# EAGLE design mixer-board2 (EAGLE 9.6.2)
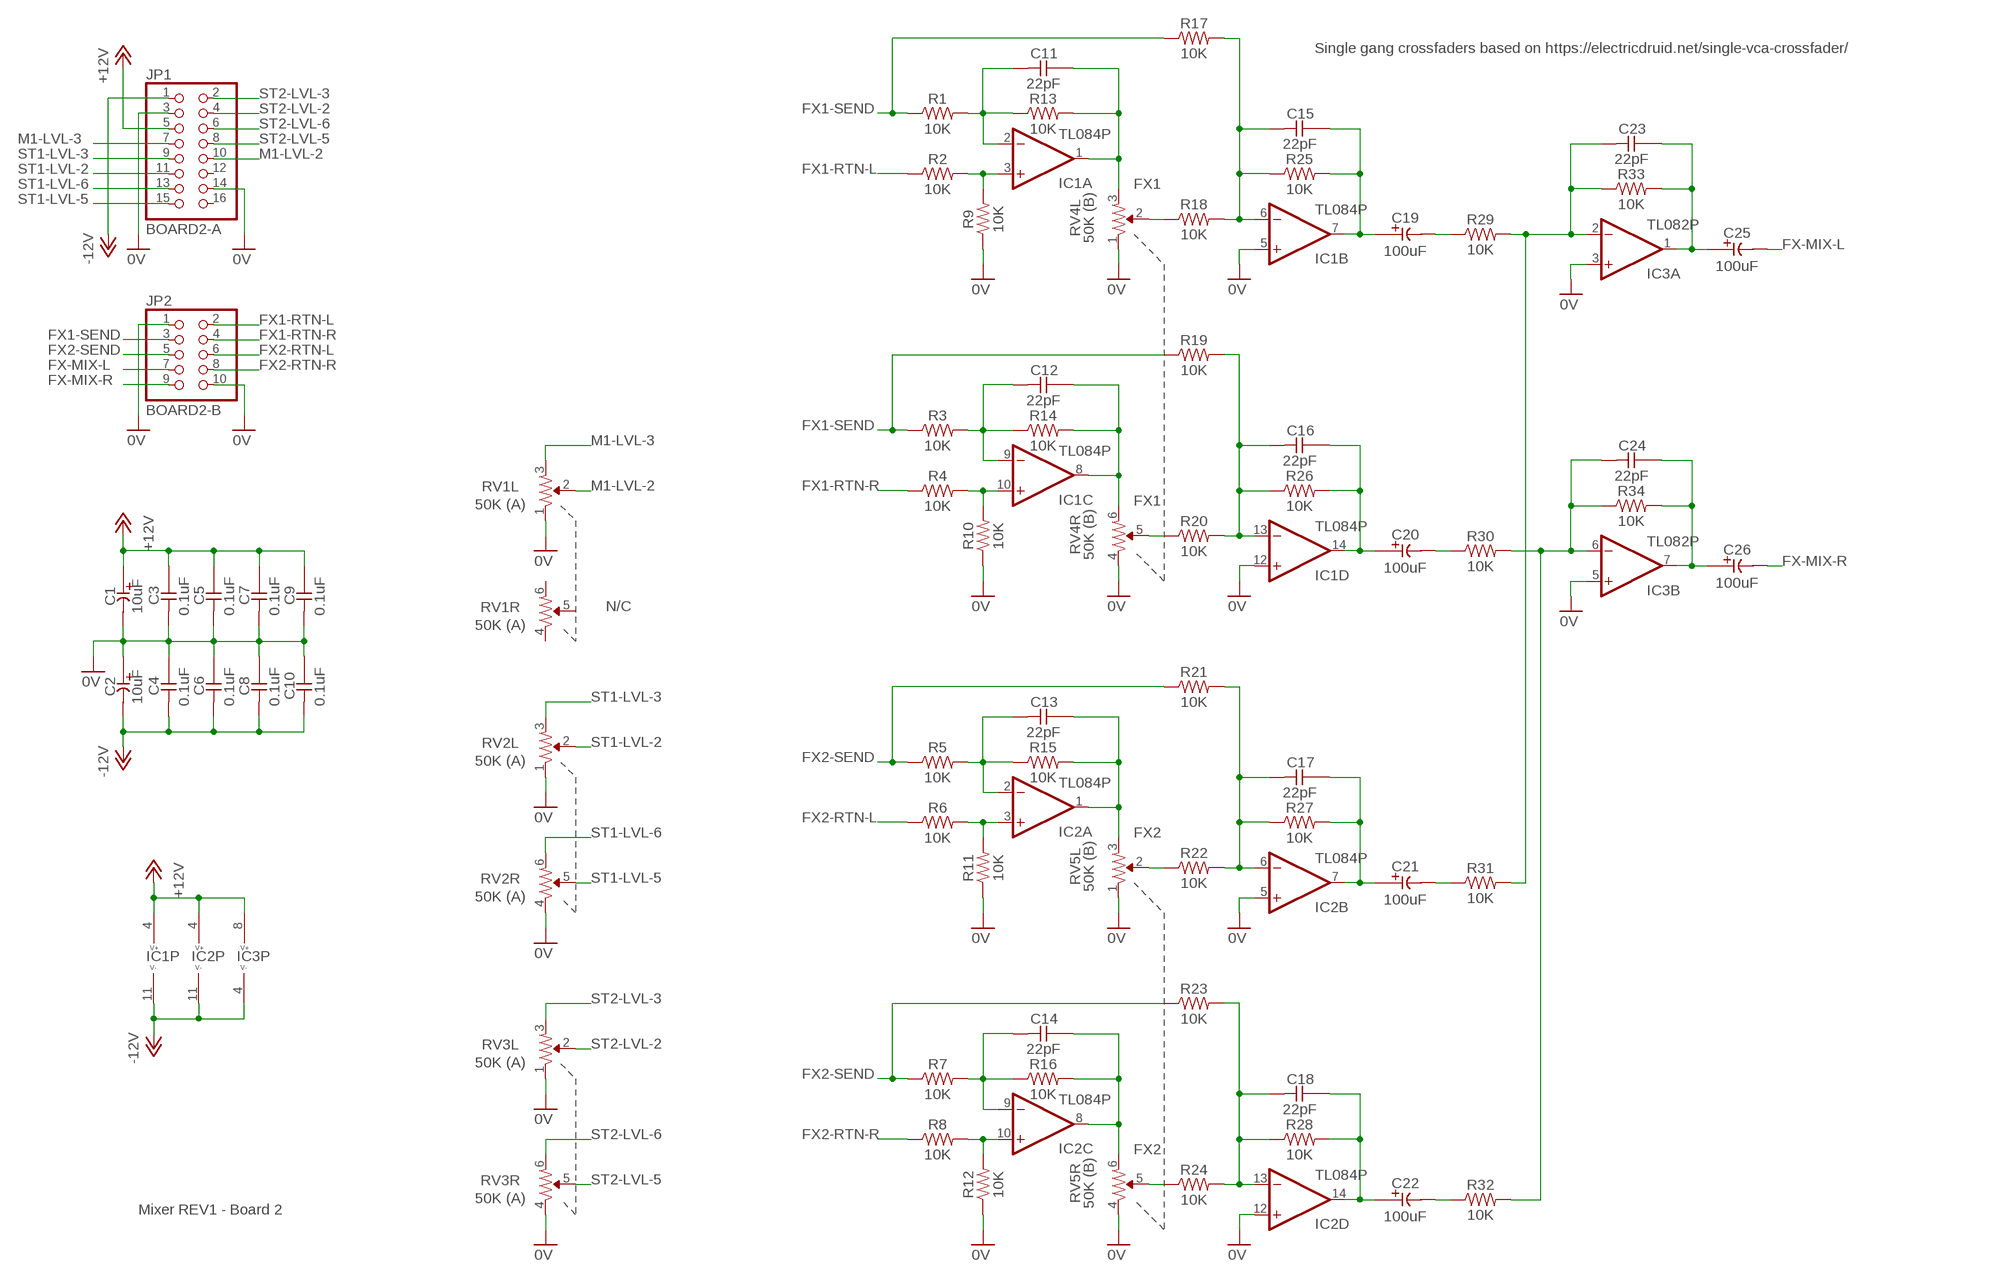
[diagram p0: schematic, sheet 1]

## Parts
C1  10uF  CE-USE2-5  [E2-5]
C2  10uF  CE-USE2-5  [E2-5]
C3  0.1uF  CC-US025-024X044  [C025-024X044]
C4  0.1uF  CC-US025-024X044  [C025-024X044]
C5  0.1uF  CC-US025-024X044  [C025-024X044]
C6  0.1uF  CC-US025-024X044  [C025-024X044]
C7  0.1uF  CC-US025-024X044  [C025-024X044]
C8  0.1uF  CC-US025-024X044  [C025-024X044]
C9  0.1uF  CC-US025-024X044  [C025-024X044]
C10  0.1uF  CC-US025-024X044  [C025-024X044]
C11  22pF  CC-US025-024X044  [C025-024X044]
C12  22pF  CC-US025-024X044  [C025-024X044]
C13  22pF  CC-US025-024X044  [C025-024X044]
C14  22pF  CC-US025-024X044  [C025-024X044]
C15  22pF  CC-US025-024X044  [C025-024X044]
C16  22pF  CC-US025-024X044  [C025-024X044]
C17  22pF  CC-US025-024X044  [C025-024X044]
C18  22pF  CC-US025-024X044  [C025-024X044]
C19  100uF  CE-USE5-8.5  [E5-8,5]
C20  100uF  CE-USE5-8.5  [E5-8,5]
C21  100uF  CE-USE5-8.5  [E5-8,5]
C22  100uF  CE-USE5-8.5  [E5-8,5]
C23  22pF  CC-US025-024X044  [C025-024X044]
C24  22pF  CC-US025-024X044  [C025-024X044]
C25  100uF  CE-USE5-8.5  [E5-8,5]
C26  100uF  CE-USE5-8.5  [E5-8,5]
IC1  TL084P  [DIL14]
IC2  TL084P  [DIL14]
IC3  TL082P  [DIL08]
JP1  BOARD2-A  PINHD-2X8  [2X08]
JP2  BOARD2-B  PINHD-2X5  [2X05]
R1  10K  R  [0207/7]
R2  10K  R  [0207/7]
R3  10K  R  [0207/7]
R4  10K  R  [0207/7]
R5  10K  R  [0207/7]
R6  10K  R  [0207/7]
R7  10K  R  [0207/7]
R8  10K  R  [0207/7]
R9  10K  R  [0207/7]
R10  10K  R  [0207/7]
R11  10K  R  [0207/7]
R12  10K  R  [0207/7]
R13  10K  R  [0207/7]
R14  10K  R  [0207/7]
R15  10K  R  [0207/7]
R16  10K  R  [0207/7]
R17  10K  R  [0207/7]
R18  10K  R  [0207/7]
R19  10K  R  [0207/7]
R20  10K  R  [0207/7]
R21  10K  R  [0207/7]
R22  10K  R  [0207/7]
R23  10K  R  [0207/7]
R24  10K  R  [0207/7]
R25  10K  R  [0207/7]
R26  10K  R  [0207/7]
R27  10K  R  [0207/7]
R28  10K  R  [0207/7]
R29  10K  R  [0207/7]
R30  10K  R  [0207/7]
R31  10K  R  [0207/7]
R32  10K  R  [0207/7]
R33  10K  R  [0207/7]
R34  10K  R  [0207/7]
RV1  50K (A)  R-VAR-ST  [_COMMON_3RP/1610G]
RV2  50K (A)  R-VAR-ST  [_COMMON_3RP/1610G]
RV3  50K (A)  R-VAR-ST  [_COMMON_3RP/1610G]
RV4  50K (B)  R-VAR-ST  [_COMMON_3RP/1610G]
RV5  50K (B)  R-VAR-ST  [_COMMON_3RP/1610G]

## Nets
0V [power]: C1.- C2.+ C3.2 C4.1 C5.2 C6.1 C7.2 C8.1 C9.2 C10.1 IC1.5(B:+IN) IC1.12(D:+IN) IC2.5(B:+IN) IC2.12(D:+IN) IC3.3(A:+IN) IC3.5(B:+IN) JP1.3 JP1.14 JP2.1 JP2.10 R9.1 R10.1 R11.1 R12.1 RV1.1 RV2.1 RV2.4 RV3.1 RV3.4 RV4.1 RV4.4 RV5.1 RV5.4
+12V [power]: C1.+ C3.1 C5.1 C7.1 C9.1 IC1.4(P:V+) IC2.4(P:V+) IC3.8(P:V+) JP1.5
-12V [power]: C2.- C4.2 C6.2 C8.2 C10.2 IC1.11(P:V-) IC2.11(P:V-) IC3.4(P:V-) JP1.1
FX1-RTN-L: JP2.2 R2.1
FX1-RTN-R: JP2.4 R4.1
FX1-SEND: JP2.3 R1.1 R3.1 R17.1 R19.1
FX2-RTN-L: JP2.6 R6.1
FX2-RTN-R: JP2.8 R8.1
FX2-SEND: JP2.5 R5.1 R7.1 R21.1 R23.1
FX-MIX-L: C25.- JP2.7
FX-MIX-R: C26.- JP2.9
M1-LVL-2: JP1.10 RV1.2
M1-LVL-3: JP1.7 RV1.3
N$1: C11.1 IC1.1(A:OUT) R13.2 RV4.3
N$2: R18.1 RV4.2
N$3: C15.2 IC1.6(B:-IN) R17.2 R18.2 R25.1
N$4: C15.1 C19.+ IC1.7(B:OUT) R25.2
N$5: C12.2 IC1.9(C:-IN) R3.2 R14.1
N$6: R20.1 RV4.5
N$7: C11.2 IC1.2(A:-IN) R1.2 R13.1
N$8: IC1.3(A:+IN) R2.2 R9.2
N$9: C19.- R29.1
N$11: C23.1 C25.+ IC3.1(A:OUT) R33.2
N$12: C12.1 IC1.8(C:OUT) R14.2 RV4.6
N$13: C13.1 IC2.1(A:OUT) R15.2 RV5.3
N$14: R22.1 RV5.2
N$15: IC1.10(C:+IN) R4.2 R10.2
N$16: C16.2 IC1.13(D:-IN) R19.2 R20.2 R26.1
N$17: C16.1 C20.+ IC1.14(D:OUT) R26.2
N$18: C17.2 IC2.6(B:-IN) R21.2 R22.2 R27.1
N$19: C20.- R30.1
N$21: C17.1 C21.+ IC2.7(B:OUT) R27.2
N$22: C24.1 C26.+ IC3.7(B:OUT) R34.2
N$23: C13.2 IC2.2(A:-IN) R5.2 R15.1
N$24: IC2.3(A:+IN) R6.2 R11.2
N$25: C21.- R31.1
N$26: C23.2 IC3.2(A:-IN) R29.2 R31.2 R33.1
N$27: C14.2 IC2.9(C:-IN) R7.2 R16.1
N$28: C14.1 IC2.8(C:OUT) R16.2 RV5.6
N$29: IC2.10(C:+IN) R8.2 R12.2
N$30: R24.1 RV5.5
N$31: C18.2 IC2.13(D:-IN) R23.2 R24.2 R28.1
N$32: C18.1 C22.+ IC2.14(D:OUT) R28.2
N$33: C22.- R32.1
N$34: C24.2 IC3.6(B:-IN) R30.2 R32.2 R34.1
ST1-LVL-2: JP1.11 RV2.2
ST1-LVL-3: JP1.9 RV2.3
ST1-LVL-5: JP1.15 RV2.5
ST1-LVL-6: JP1.13 RV2.6
ST2-LVL-2: JP1.4 RV3.2
ST2-LVL-3: JP1.2 RV3.3
ST2-LVL-5: JP1.8 RV3.5
ST2-LVL-6: JP1.6 RV3.6
Unconnected: JP1.12 JP1.16 RV1.4 RV1.5 RV1.6

## Notes on the sheet
- Single gang crossfaders based on https://electricdruid.net/single-vca-crossfader/
- FX1
- FX1
- N/C
- FX2
- FX2
- Mixer REV1 - Board 2

## Library data of the parts
C1 C2 = _common.v1:CE-US: ELECTROLYTIC CAPACITOR, US symbol
C3-C10 = _common.v1:CC-US: CAPACITOR, US symbol
C11-C18 C23 C24 = _common:CC-US: CAPACITOR, US symbol
C19-C22 C25 C26 = _common:CE-US: ELECTROLYTIC CAPACITOR, US symbol
IC1 IC2 = _common:TL084: OP AMP
IC3 = _common:TL082: OP AMP
JP1 = pinhead:PINHD-2X8: PIN HEADER
JP2 = pinhead:PINHD-2X5: PIN HEADER
R1-R34 = _common:R: RESISTOR, US symbol
RV1-RV5 = _common:R-VAR-ST

## Net classes
0 default: width 0.305 mm, clearance 0.305 mm
1 power: width 0.711 mm, clearance 0.305 mm

## Board
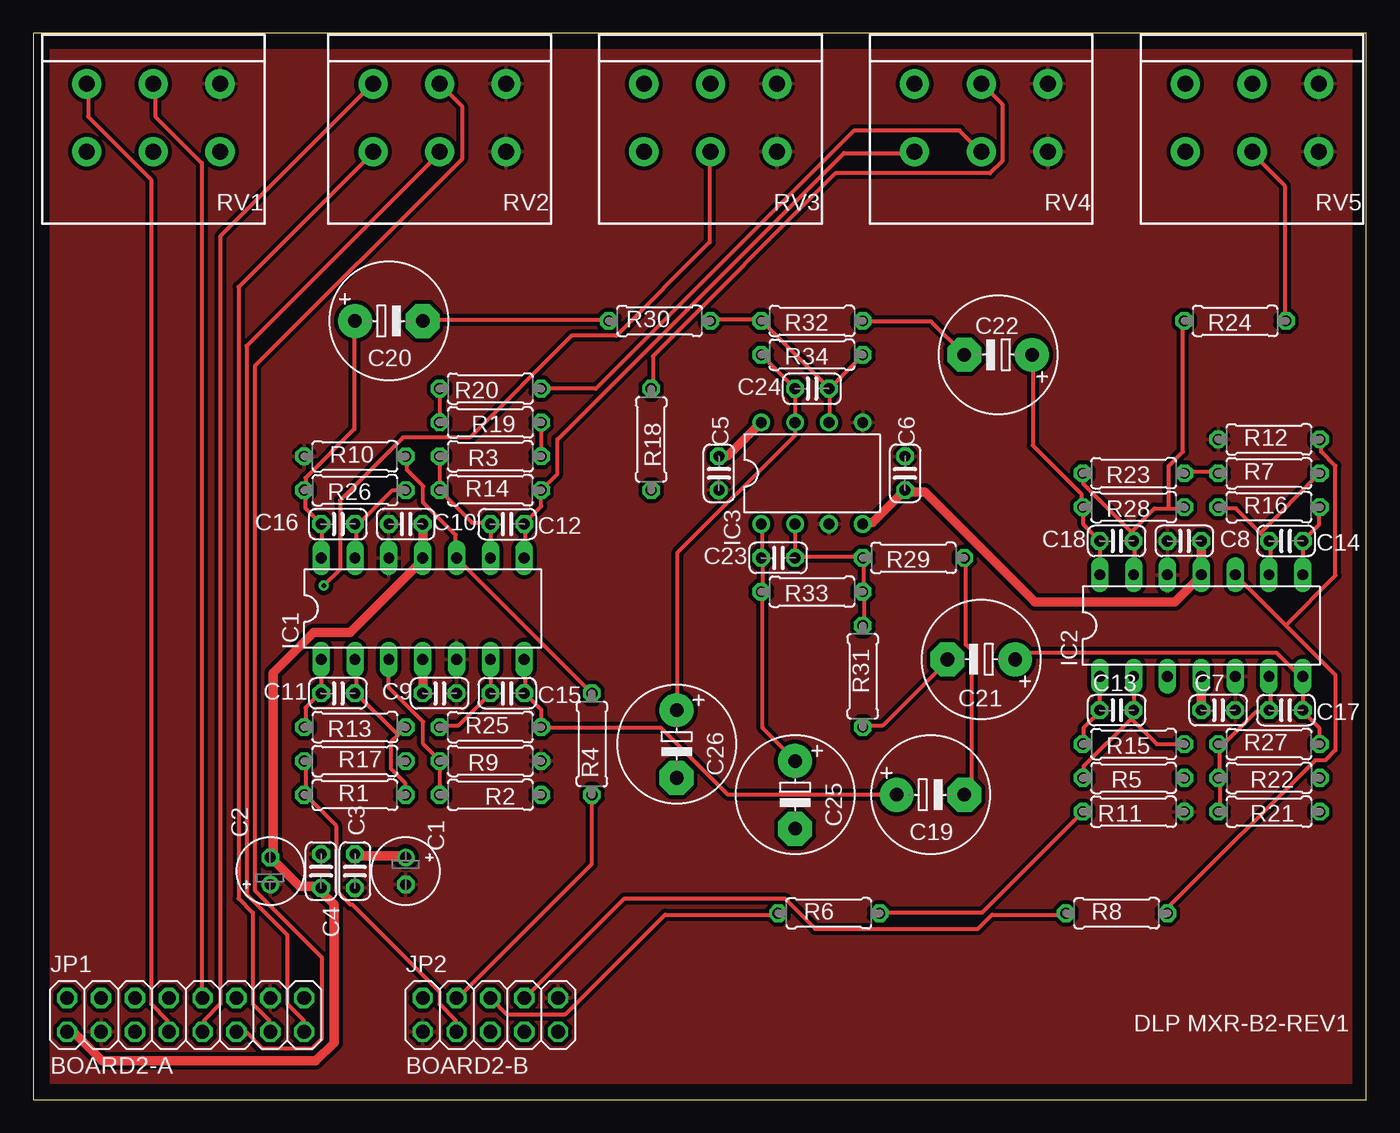
[diagram p1: board, top side]
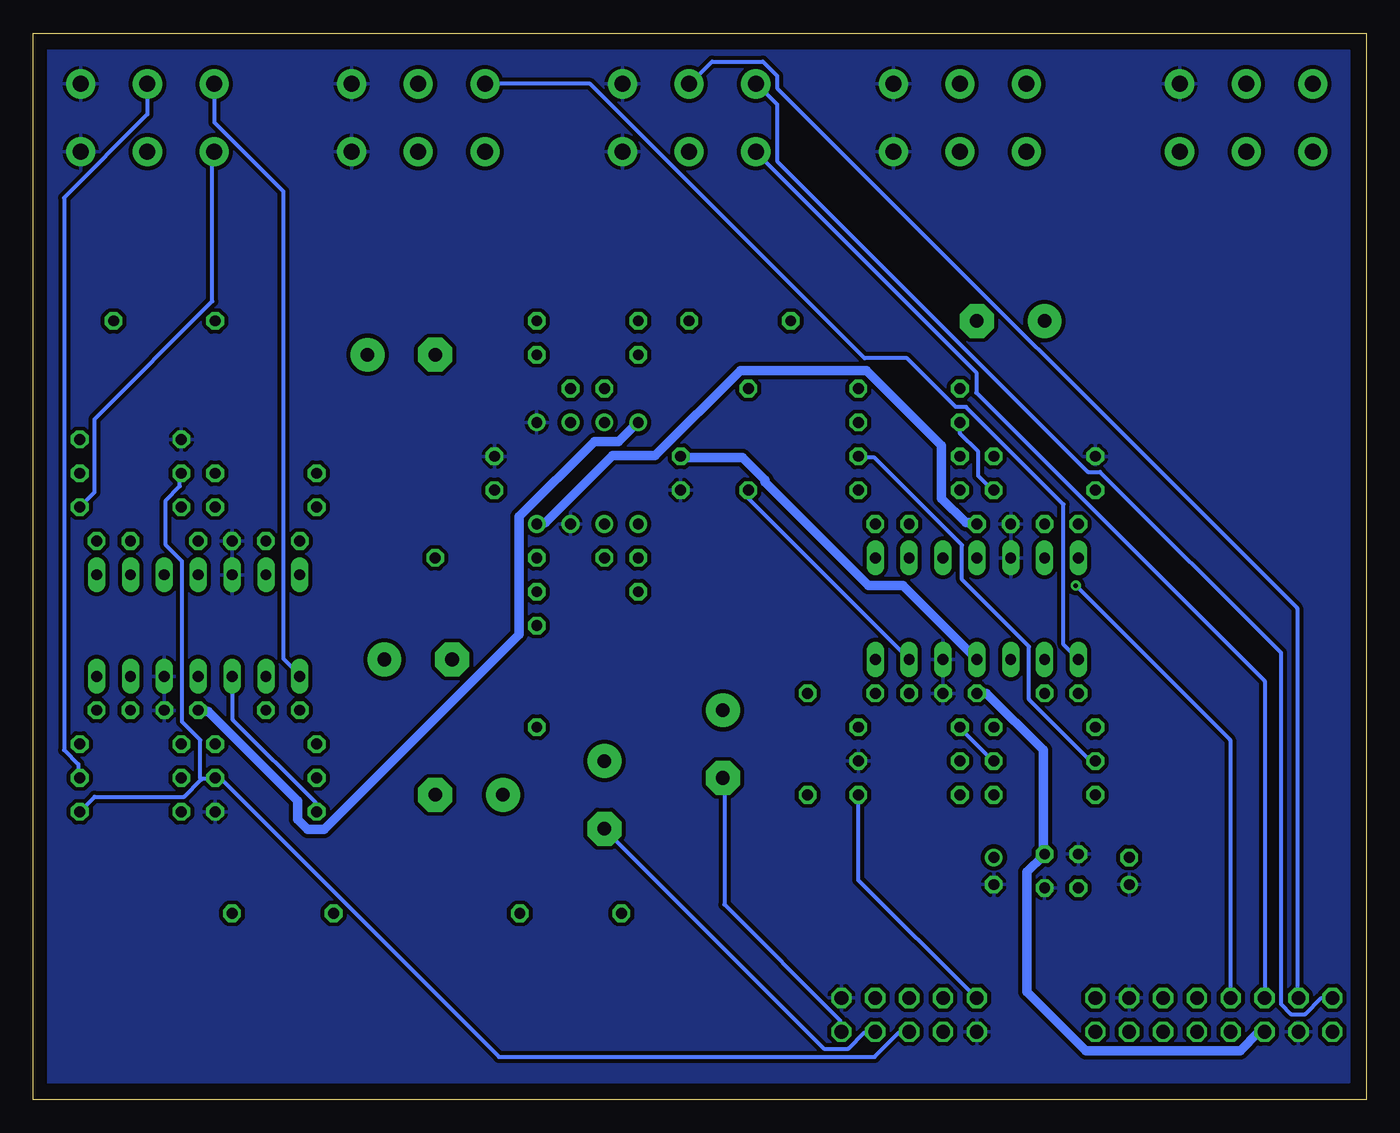
[diagram p2: board, bottom side, seen from below]

Size 100 x 80 mm. Coordinates in mm from the lower left corner, seen from the top.
Outline: 0,0 100,0 100,80 0,80 0,0
Copper layers (1*16): Top 0.035mm / dielectric 1.5mm / Bottom 0.035mm
Design rules "default": minimum track width 6mil, minimum drill 0.35mm, track to track 6mil, track to pad 6mil, pad to pad 6mil, via to via 6mil, smd to smd 6mil, copper to edge 40mil, drill to drill 6mil, minimum pad ring 10mil, minimum via ring 8mil, stop-mask expansion 4mil, vias tented up to drill 0mil, thermal gap 10mil

### Footprints (pad centres in the part's own frame; a part is rotated, then mirrored left to right if it is on the bottom)
E2-5 = drill 0.813 pad 1.27: + -1.016,0 | drill 0.813 pad 1.27 octagon: - 1.016,0
C025-024X044 = drill 0.813 octagon: 1 -1.27,0; 2 1.27,0
E5-8,5 = drill 1.016 pad 2.54: + -2.54,0 | drill 1.016 pad 2.54 octagon: - 2.54,0
DIL14 = drill 0.813 long: 1 -7.62,-3.81; 2 -5.08,-3.81; 3 -2.54,-3.81; 4 0,-3.81; 5 2.54,-3.81; 6 5.08,-3.81; 7 7.62,-3.81; 8 7.62,3.81; 9 5.08,3.81; 10 2.54,3.81; 11 0,3.81; 12 -2.54,3.81; 13 -5.08,3.81; 14 -7.62,3.81
DIL08 = drill 0.813 pad 1.27: 1 -3.81,-3.81; 2 -1.27,-3.81; 3 1.27,-3.81; 4 3.81,-3.81; 5 3.81,3.81; 6 1.27,3.81; 7 -1.27,3.81; 8 -3.81,3.81
2X08 = drill 1.016 octagon: 1 -8.89,-1.27; 2 -8.89,1.27; 3 -6.35,-1.27; 4 -6.35,1.27; 5 -3.81,-1.27; 6 -3.81,1.27; 7 -1.27,-1.27; 8 -1.27,1.27; 9 1.27,-1.27; 10 1.27,1.27; 11 3.81,-1.27; 12 3.81,1.27; 13 6.35,-1.27; 14 6.35,1.27; 15 8.89,-1.27; 16 8.89,1.27
2X05 = drill 1.016 octagon: 1 -5.08,-1.27; 2 -5.08,1.27; 3 -2.54,-1.27; 4 -2.54,1.27; 5 0,-1.27; 6 0,1.27; 7 2.54,-1.27; 8 2.54,1.27; 9 5.08,-1.27; 10 5.08,1.27
0207/7 = drill 0.813 octagon: 1 -3.81,0; 2 3.81,0
_COMMON_3RP/1610G = drill 1.2 pad 2.184: 1 -5,0; 2 0,0; 3 5,0; 4 -5,5.08; 5 0,5.08; 6 5,5.08

### Placement (x,y rotation side)
C1  27.94,17.14 270 top
C2  17.78,17.14 90 top
C3  24.13,17.14 270 top
C4  21.59,17.14 270 top
C5  51.44,46.99 270 top
C6  65.41,46.99 270 top
C7  88.9,29.21 0 top
C8  86.36,41.91 0 top
C9  30.48,30.48 0 top
C10  27.94,43.18 0 top
C11  22.86,30.48 0 top
C12  35.56,43.18 180 top
C13  81.28,29.21 0 top
C14  93.98,41.91 180 top
C15  35.56,30.48 180 top
C16  22.86,43.18 0 top
C17  93.98,29.21 180 top
C18  81.28,41.91 0 top
C19  67.31,22.86 0 top
C20  26.67,58.42 0 top
C21  71.12,33.02 180 top
C22  72.39,55.88 180 top
C23  55.88,40.64 0 top
C24  58.42,53.34 0 top
C25  57.15,22.86 270 top
C26  48.26,26.67 270 top
IC1  29.21,36.83 0 top
IC2  87.63,35.56 0 top
IC3  58.42,46.99 0 top
JP1  11.43,6.35 0 top
JP2  34.29,6.35 0 top
R1  24.13,22.86 0 top
R2  34.29,22.86 180 top
R3  34.29,48.26 180 top
R4  41.91,26.67 90 top
R5  82.55,24.13 180 top
R6  59.69,13.97 0 top
R7  92.71,46.99 0 top
R8  81.28,13.97 0 top
R9  34.29,25.4 180 top
R10  24.13,48.26 0 top
R11  82.55,21.59 180 top
R12  92.71,49.53 0 top
R13  24.13,27.94 180 top
R14  34.29,45.72 0 top
R15  82.55,26.67 180 top
R16  92.71,44.45 0 top
R17  24.13,25.4 0 top
R18  46.35,49.53 270 top
R19  34.29,50.8 180 top
R20  34.29,53.34 180 top
R21  92.71,21.59 180 top
R22  92.71,24.13 180 top
R23  82.55,46.99 180 top
R24  90.17,58.42 180 top
R25  34.29,27.94 0 top
R26  24.13,45.72 180 top
R27  92.71,26.67 0 top
R28  82.55,44.45 180 top
R29  66.04,40.64 180 top
R30  46.99,58.42 0 top
R31  62.23,31.75 90 top
R32  58.42,58.42 180 top
R33  58.42,38.1 180 top
R34  58.42,55.88 180 top
RV1  9,76.2 180 top
RV2  30.48,76.2 180 top
RV3  50.8,76.2 180 top
RV4  71.12,76.2 180 top
RV5  91.44,76.2 180 top

### Tracks (layer width: path | path; a pad name or v marks a point on that pad's centre or on a via)
0V
  pour Top: 1.27,1.27 99.06,1.27 99.06,78.74 1.27,78.74
  pour Bottom: 1.27,1.27 99.06,1.27 99.06,78.74 1.27,78.74
+12V
  Top 0.711: C9.1 29.26,30.48 29.26,32.92 IC1.4 | C3.1 24.23,18.29 27.89,18.29 C1.+ | IC2.4 C7.1 | IC3.8 52.12,48.31 51.51,48.31 C5.1
  Bottom 0.711: JP1.5 7.62,5.03 8.08,5.03 9.45,3.66 21.03,3.66 25.45,8.08 25.45,17.07 24.23,18.29 C3.1 24.23,18.75 24.23,26.21 28.5,30.48 C9.1 | C7.1 87.63,29.11 86.87,29.11 80.16,22.4 80.16,21.03 79.4,20.27 78.18,20.27 63.55,34.9 63.55,43.74 57.91,49.38 56.08,49.38 54.71,50.75 IC3.8 | IC1.4 34.75,38.56 37.34,38.56 45.11,46.33 45.11,46.48 46.79,48.16 51.36,48.16 C5.1
-12V
  Top 0.711: C8.2 IC2.11 87.48,39.17 85.65,37.34 75.13,37.34 66.9,45.57 65.68,45.57 C6.2 65.38,45.72 62.94,43.28 62.33,43.28 IC3.4 | C10.2 29.26,43.13 29.26,40.69 IC1.11 29.11,40.39 23.77,35.05 21.03,35.05 17.98,32 17.98,18.44 C2.- 17.83,18.14 19.96,16 21.49,16 C4.2 21.64,15.54 22.55,14.63 22.55,4.27 21.18,2.9 5.18,2.9 3.05,5.03 2.59,5.03 JP1.1
  Bottom 0.711: IC3.4 62.18,43.28 61.57,43.28 56.54,48.31 53.34,48.31 46.94,54.71 37.49,54.71 31.85,49.07 31.85,45.11 30.02,43.28 29.26,43.28 C10.2
FX1-RTN-L
  Bottom 0.305: R2.1 38.1,16.46 29.26,7.62 JP2.2
FX1-RTN-R
  Top 0.305: R4.1 41.91,17.68 31.85,7.62 JP2.4
FX1-SEND
  Top 0.305: R19.1 R3.1 | 20.42,22.86 20.42,25.3 R17.1 | 20.42,22.86 22.71,20.57 22.71,15.7 23.77,14.63 23.93,14.63 30.48,8.08 30.48,7.16 31.7,5.94 31.7,5.18 JP2.3 | 20.42,22.86 R1.1
  Bottom 0.305: R3.1 38.1,48.16 36.88,48.16 30.33,41.6 30.33,39.01 25.3,33.98 25.3,30.02 20.73,25.45 20.42,25.45 R17.1
FX2-RTN-L
  Top 0.305: JP2.6 35.51,6.4 39.93,6.4 47.4,13.87 55.78,13.87 R6.1
FX2-RTN-R
  Top 0.305: R8.1 77.42,13.87 71.93,13.87 70.87,12.8 58.67,12.8 56.39,15.09 44.35,15.09 36.88,7.62 JP2.8
FX2-SEND
  Top 0.305: R23.1 86.41,47.09 88.85,47.09 R7.1
  Bottom 0.305: 87.4,24 88.7,22.71 95.4,22.71 R21.1 | 87.4,24 87.33,24.08 86.41,24.08 R5.1 86.26,24.08 85.95,24.08 65.08,3.2 36.88,3.2 35.05,5.03 34.29,5.03 JP2.5 | R7.1 89,46.94 89,46.02 90.07,44.96 90.07,41.6 88.85,40.39 88.85,28.35 87.48,26.98 87.48,24.08 87.4,24
FX-MIX-L
  Bottom 0.305: JP2.7 36.88,5.03 37.64,5.03 38.86,3.81 40.69,3.81 57.15,20.27 C25.-
FX-MIX-R
  Bottom 0.305: JP2.9 39.47,5.18 39.47,5.94 48.16,14.63 48.16,24.08 C26.-
M1-LVL-2
  Top 0.305: JP1.10 12.65,7.62 12.65,70.26 9.14,73.76 9.14,76.2 RV1.2
M1-LVL-3
  Top 0.305: JP1.7 10.06,5.18 10.06,5.94 8.84,7.16 8.84,69.04 4.12,73.76 4.12,76.2 RV1.3
N$1
  Top 0.305: R13.2 20.42,28.04 20.42,29.41 21.49,30.48 C11.1 21.64,30.48 21.64,32.92 IC1.1
  Bottom 0.305: RV4.3 58.22,76.2 37.64,55.63 34.44,55.63 30.79,51.97 30.02,51.97 22.71,44.65 22.71,34.14 IC1.1
N$2
  Top 0.305: R18.1 46.48,53.34 46.48,55.78 60.2,69.49 71.78,69.49 72.69,70.41 72.69,74.68 71.17,76.2 RV4.2
N$3
  Top 0.305: IC1.6 C15.2 31.85,28.04 30.48,28.04 R25.1
  Bottom 0.305: R17.2 28.04,25.45 30.48,27.89 R25.1 | R18.2 46.33,45.72 46.33,45.11 34.29,33.07 IC1.6
N$4
  Top 0.305: 36.88,30.48 36.88,32.92 IC1.7 | 36.88,30.48 38.1,29.26 R25.2 38.1,27.89 47.09,27.89 52.12,22.86 C19.+ | 36.88,30.48 C15.1
N$5
  Top 0.305: IC1.9 C12.2 34.29,43.28 32.92,43.28 R14.1 R3.2
N$6
  Top 0.305: R20.1 42.22,53.34 61.57,72.69 69.49,72.69 71.02,71.17 RV4.5
N$7
  Top 0.305: 24.23,30.48 24.23,32.92 IC1.2 | R13.1 27.36,27.36 | 27.36,27.36 26.82,26.82 26.82,24.84 27.89,23.77 27.89,22.86 R1.2 | 27.36,27.36 24.23,30.48 | 24.23,30.48 C11.2
N$8
  Top 0.305: R2.2 R9.2 30.48,25.45 29.26,26.67 29.26,28.35 26.67,30.94 IC1.3
N$9
  Top 0.305: R29.1 69.95,40.54 69.95,34.14 70.41,33.68 70.41,23.32 69.95,22.86 C19.-
N$11
  Top 0.305: 54.71,38.1 54.71,40.54 C23.1 54.71,40.69 54.71,43.13 IC3.1 | 54.71,38.1 54.71,27.89 57.15,25.45 C25.+ | 54.71,38.1 R33.2
N$12
  Top 0.305: IC1.8 36.88,40.69 36.88,43.13 C12.1 36.88,43.28 38.1,44.5 R14.2 39.32,46.94 39.32,49.53 60.81,71.02 65.99,71.02 RV4.6
N$13
  Top 0.305: R15.2 78.79,26.67 78.79,27.89 80.01,29.11 C13.1 IC2.1
  Bottom 0.305: RV5.3 86.41,76.2 86.41,73.3 81.23,68.12 81.23,33.07 80.01,31.85 IC2.1
N$14
  Bottom 0.305: RV5.2 91.44,73.91 97.69,67.67 97.69,26.21 96.62,25.15 96.62,24.23 R22.1
N$15
  Top 0.305: R4.2 IC1.10 31.7,40.69 31.7,42.37 29.26,44.81 29.26,46.02 28.04,47.24 28.04,48.16 R10.2
N$16
  Top 0.305: R20.2 R19.2 | IC1.13 24.23,40.69 24.23,43.13 C16.2 24.38,43.13 26.98,45.72 R26.1
  Bottom 0.305: R19.2 30.48,49.99 29.11,48.62 29.11,46.79 28.04,45.72 R26.1
N$17
  Top 0.305: IC1.14 21.64,40.69 21.64,43.13 C16.1 20.42,44.35 20.42,45.72 | 20.42,45.72 20.42,46.63 24.08,50.29 24.08,58.37 C20.+ | 20.42,45.72 R26.2
N$18
  Top 0.305: IC2.6 92.81,31.7 92.81,29.26 C17.2 92.66,29.11 91.75,29.11 89,26.36 | R21.2 89,21.64 89,24.08 R22.2 89,24.23 89,26.36 | 89,26.36 89,26.67 R27.1 89,26.36
N$19
  Top 0.305: R30.1 43.13,58.52 29.26,58.52 C20.-
N$21
  Top 0.305: R27.2 96.47,26.67 96.47,27.89 95.25,29.11 C17.1 IC2.7 95.25,31.85 94.94,31.85 93.27,33.53 74.22,33.53 73.76,33.07 C21.+
N$22
  Top 0.305: R34.2 C24.1 IC3.7 57.15,49.84 48.31,41 48.31,29.26 C26.+
N$23
  Top 0.305: 82.37,28.57 82.45,28.65 82.45,29.11 C13.2 82.6,29.26 82.6,31.7 IC2.2 | 82.37,28.57 78.79,24.99 78.79,24.23 R5.2 | R15.1 84.28,26.67 82.37,28.57
N$24
  Top 0.305: R11.2 71.17,14.02 63.55,14.02 R6.2
  Bottom 0.305: IC2.3 85.04,31.7 85.04,28.5 78.79,22.25 78.79,21.64 R11.2
N$25
  Top 0.305: R31.1 62.33,28.04 63.7,28.04 68.58,32.92 C21.-
N$26
  Top 0.305: IC3.2 57.15,40.69 | 62.33,38.1 62.33,35.66 R31.2 | 62.33,38.1 62.33,40.54 R29.2 62.18,40.69 57.15,40.69 | 62.33,38.1 R33.1 | 57.15,40.69 C23.2
N$27
  Top 0.305: IC2.9 92.81,39.47 92.81,41.91 C14.2 92.66,41.91 92.05,42.52 | 92.05,42.52 90.22,44.35 89,44.35 R16.1 | 92.05,42.52 R7.2
N$28
  Top 0.305: IC2.8 C14.1 96.47,43.13 96.47,44.35 R16.2
  Bottom 0.305: R16.2 95.4,45.57 95.4,51.05 86.56,59.89 86.56,71.02 RV5.6
N$29
  Top 0.305: IC2.10 93.95,35.59 | 93.95,35.59 97.69,31.85 97.69,26.21 96.93,25.45 96.16,25.45 85.19,14.48 85.19,14.02 R8.2 | 93.95,35.59 97.69,39.32 97.69,47.55 96.62,48.62 96.62,49.53 R12.2
N$30
  Top 0.305: R24.1 93.88,58.52 93.88,68.58 91.44,71.02 RV5.5
N$31
  Top 0.305: IC2.13 82.6,39.47 82.6,41.91 C18.2 82.45,41.91 82.45,42.52 82.37,42.6 | 82.37,42.6 78.79,46.18 78.79,46.94 R23.2 | 85.19,44.35 84.12,44.35 82.37,42.6 | 85.19,44.35 86.26,44.35 R28.1 | 85.19,44.35 85.19,47.55 86.26,48.62 86.26,58.37 R24.2
N$32
  Top 0.305: IC2.14 C18.1 78.79,43.13 78.79,44.35 R28.2 78.64,44.5 78.64,45.41 74.98,49.07 74.98,55.78 C22.+
N$33
  Top 0.305: C22.- 67.36,58.37 62.33,58.37 R32.1
N$34
  Top 0.305: R30.2 50.9,58.52 54.56,58.52 R32.2 54.71,58.37 59.74,53.34 | 59.74,53.34 59.74,50.9 IC3.6 | 59.74,53.34 62.18,55.78 R34.1 | 59.74,53.34 C24.2
ST1-LVL-2
  Top 0.305: RV2.2 32.16,74.52 32.16,70.56 16.61,55.02 16.61,15.7 21.64,10.67 21.64,4.57 20.88,3.81 17.22,3.81 16,5.03 15.24,5.03 JP1.11
ST1-LVL-3
  Top 0.305: JP1.9 12.8,5.18 12.8,5.94 14.02,7.16 14.02,64.77 25.45,76.2 RV2.3
ST1-LVL-5
  Top 0.305: JP1.15 20.27,5.18 20.27,5.94 19.05,7.16 19.05,12.34 16,15.39 16,56.54 30.48,71.02 RV2.5
ST1-LVL-6
  Top 0.305: JP1.13 17.68,5.18 17.68,5.94 16.46,7.16 16.46,14.02 15.39,15.09 15.39,60.96 25.45,71.02 RV2.6
ST2-LVL-2
  Bottom 0.305: JP1.4 5.18,7.62 5.18,36.88 44.2,75.89 44.2,76.81 45.26,77.88 49.07,77.88 50.75,76.2 RV3.2
ST2-LVL-3
  Bottom 0.305: JP1.2 3.35,7.62 4.57,6.4 5.64,6.4 6.4,7.16 6.4,33.53 19.96,47.09 20.88,47.09 44.2,70.41 44.2,74.68 45.72,76.2 RV3.3
ST2-LVL-5  (via drill 0.35)
  Top 0.305: v21.79,38.56 23.01,39.78 23.01,44.96 27.74,49.68 32.77,49.68 40.39,57.3 43.74,57.3 50.75,64.31 50.75,71.02 RV3.5
  Bottom 0.305: v21.79,38.56 10.21,26.98 10.21,7.62 JP1.8
ST2-LVL-6
  Bottom 0.305: JP1.6 7.62,31.39 29.26,53.03 29.26,54.56 45.72,71.02 RV3.6

### Text on the board
tNames: DLP MXR-B2-REV1 | BOARD2-A | BOARD2-B